# EAGLE schematic PCB2022-20-02 (EAGLE 9.6.2)
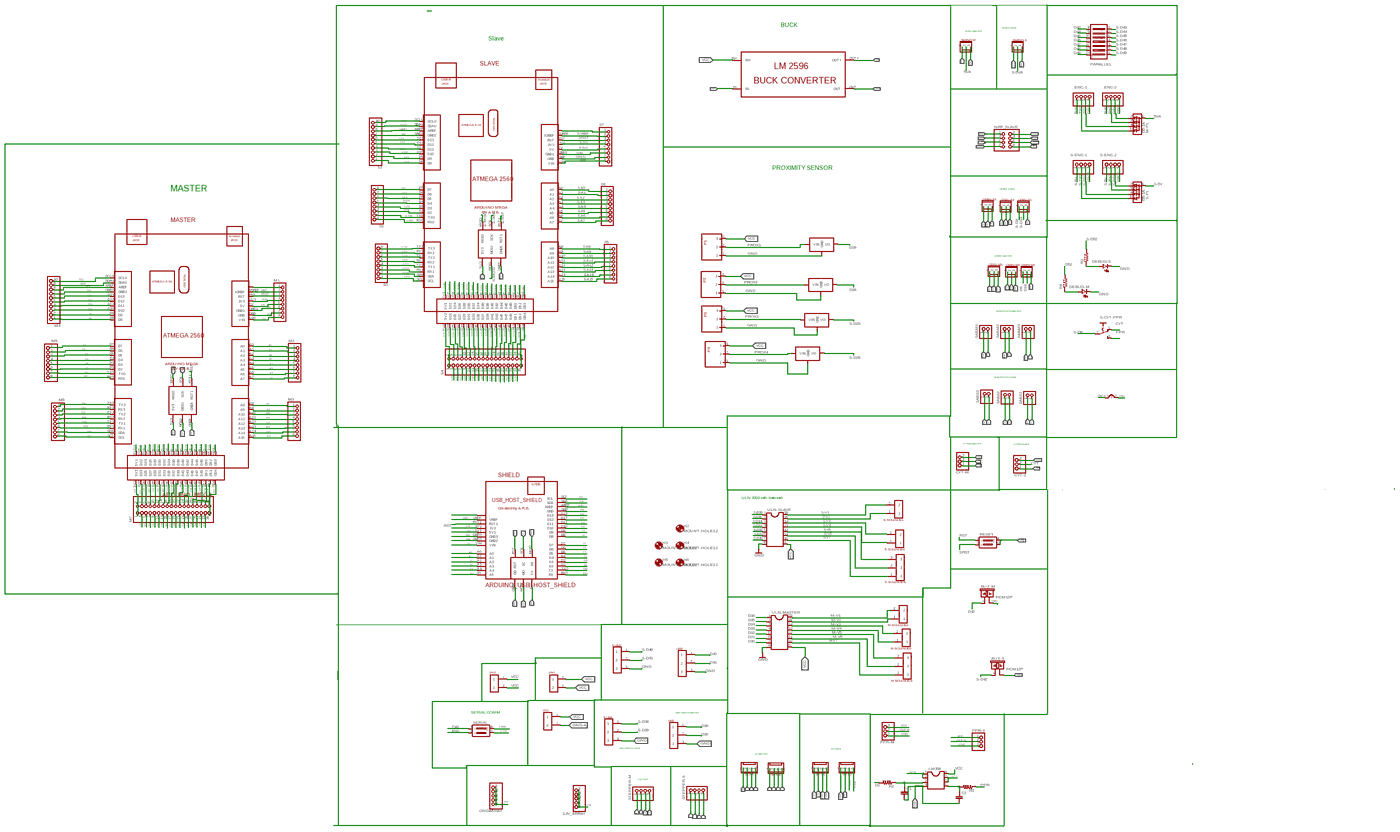
[diagram p0: schematic, sheet 1, overview]
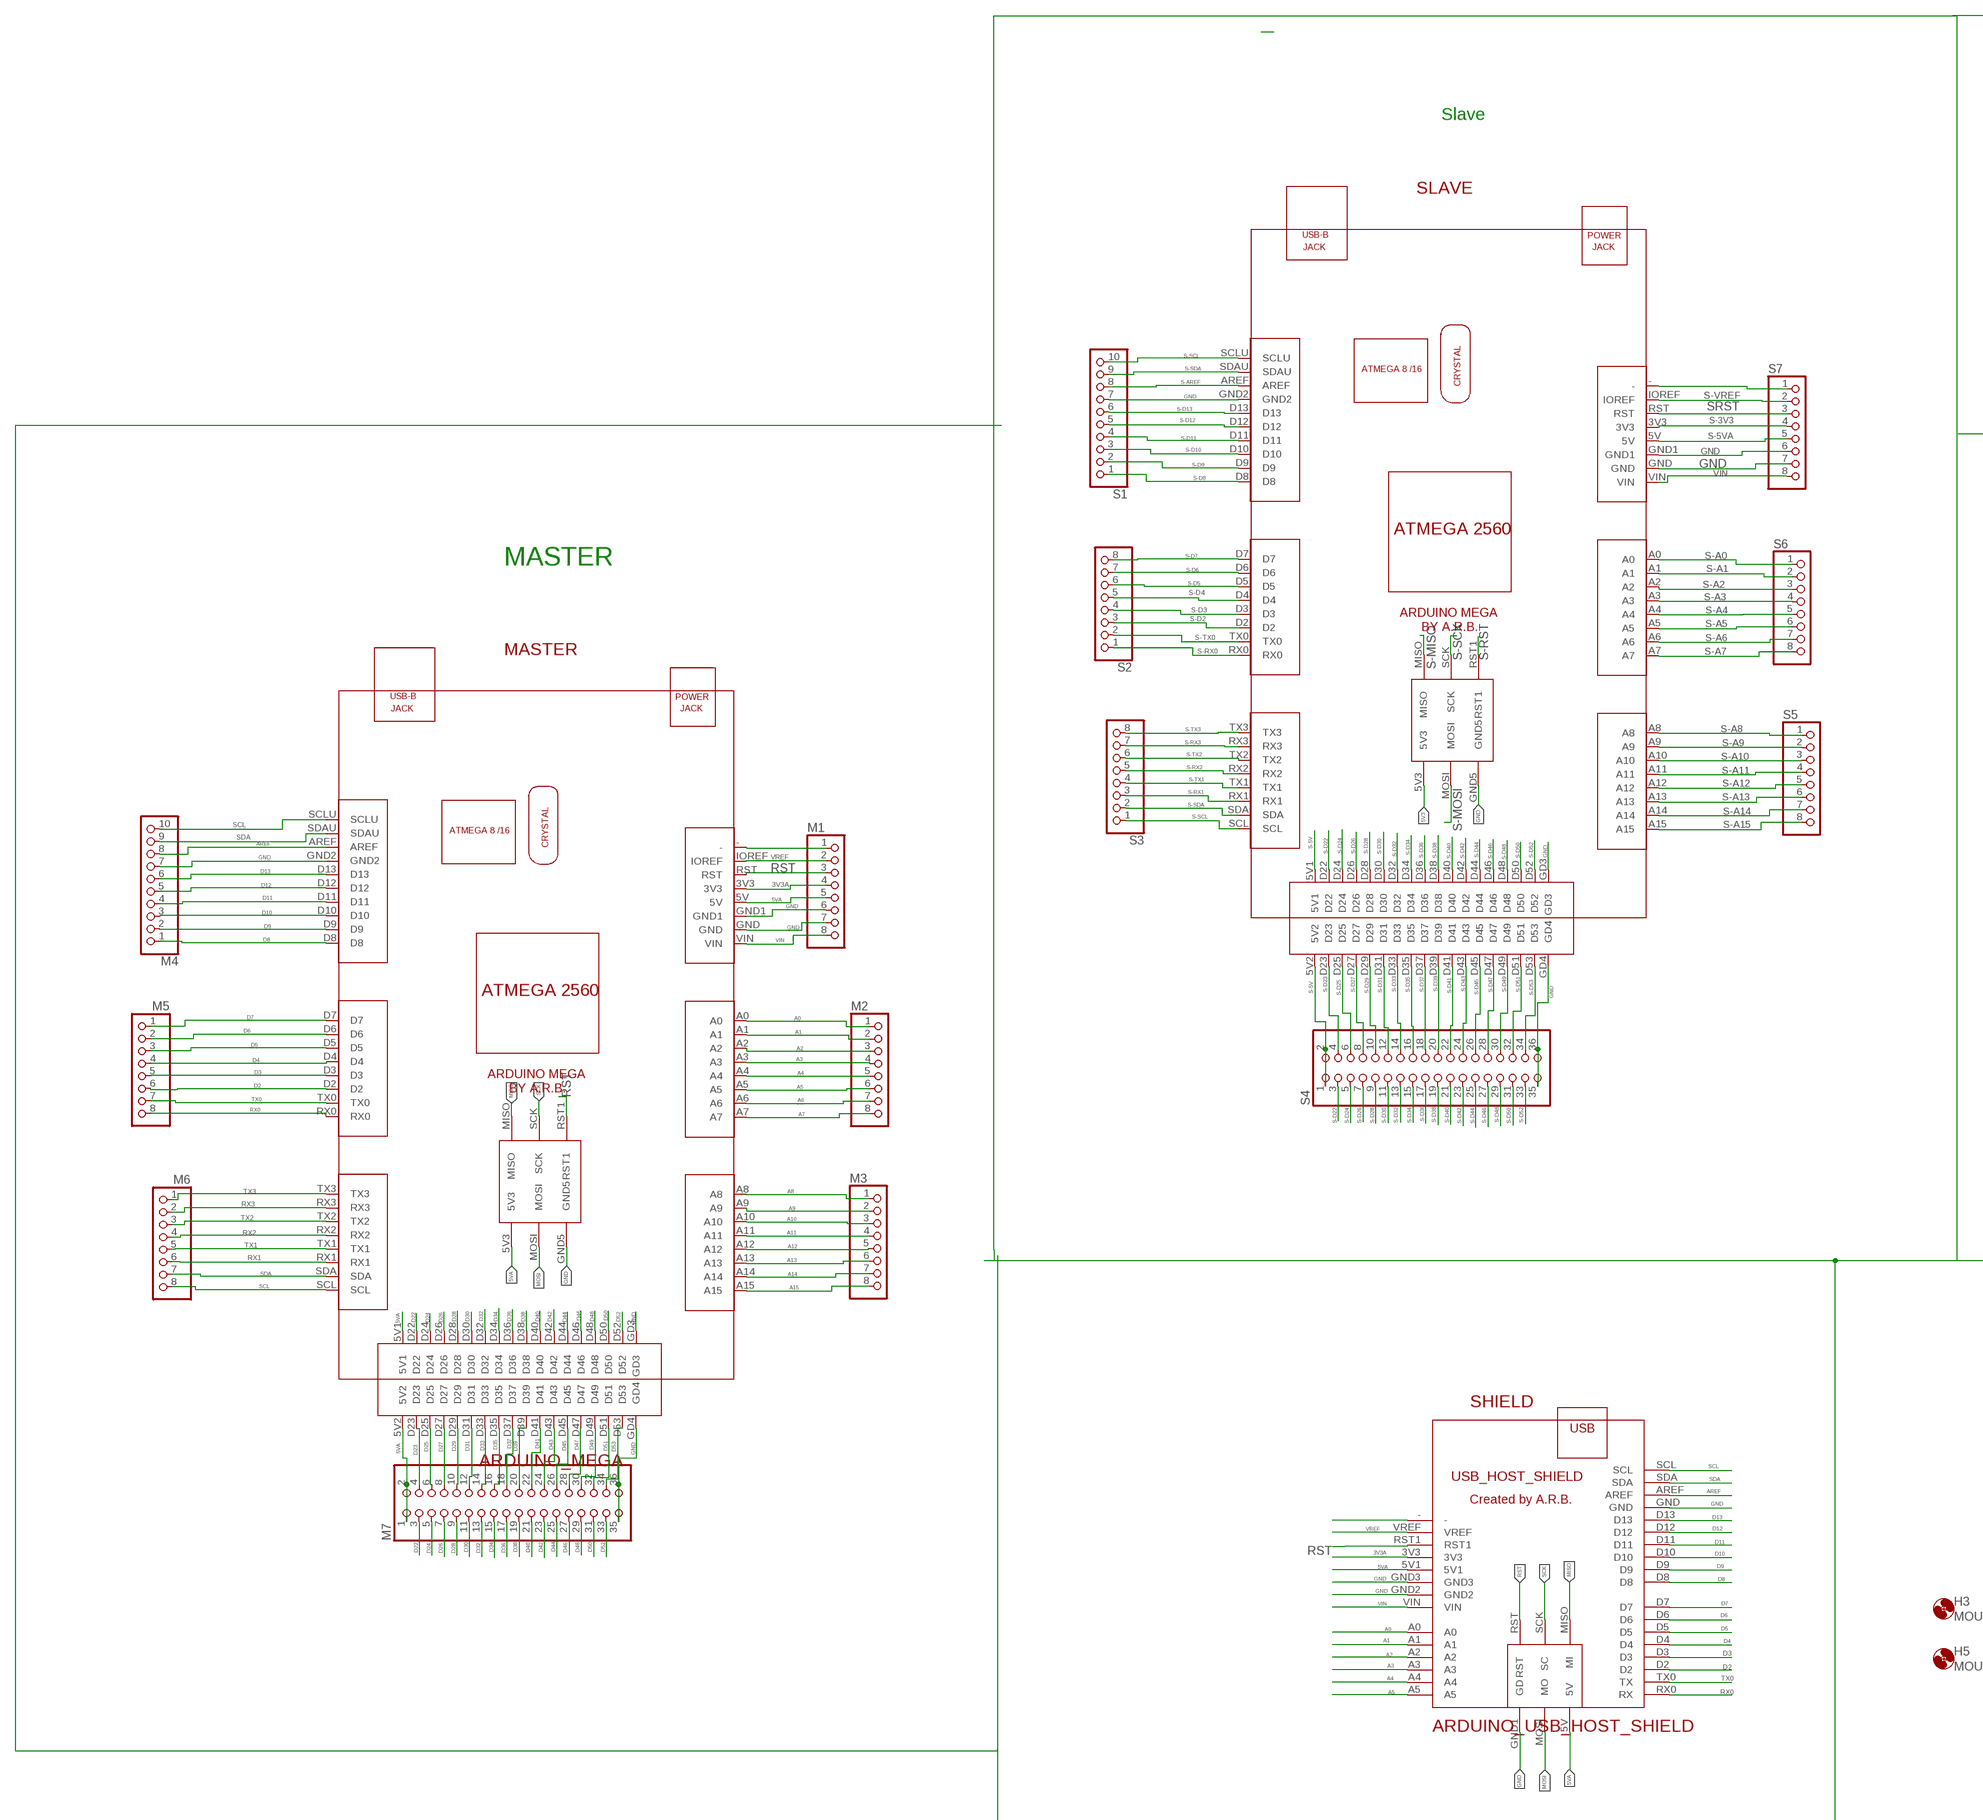
[diagram p1: schematic, sheet 1, part 1 of 4]
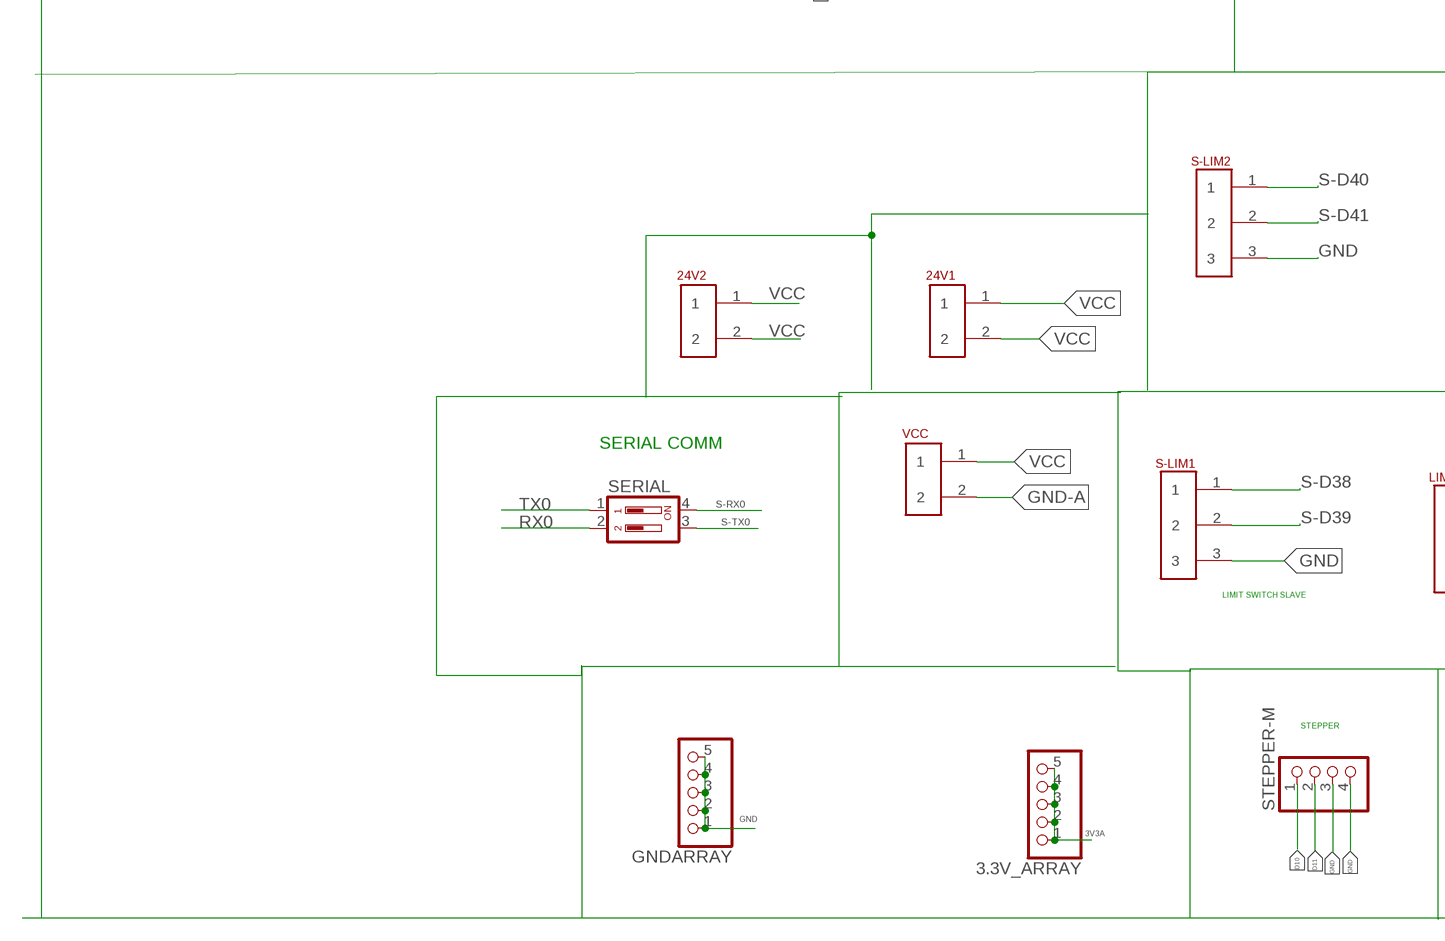
[diagram p2: schematic, sheet 1, part 2 of 4]
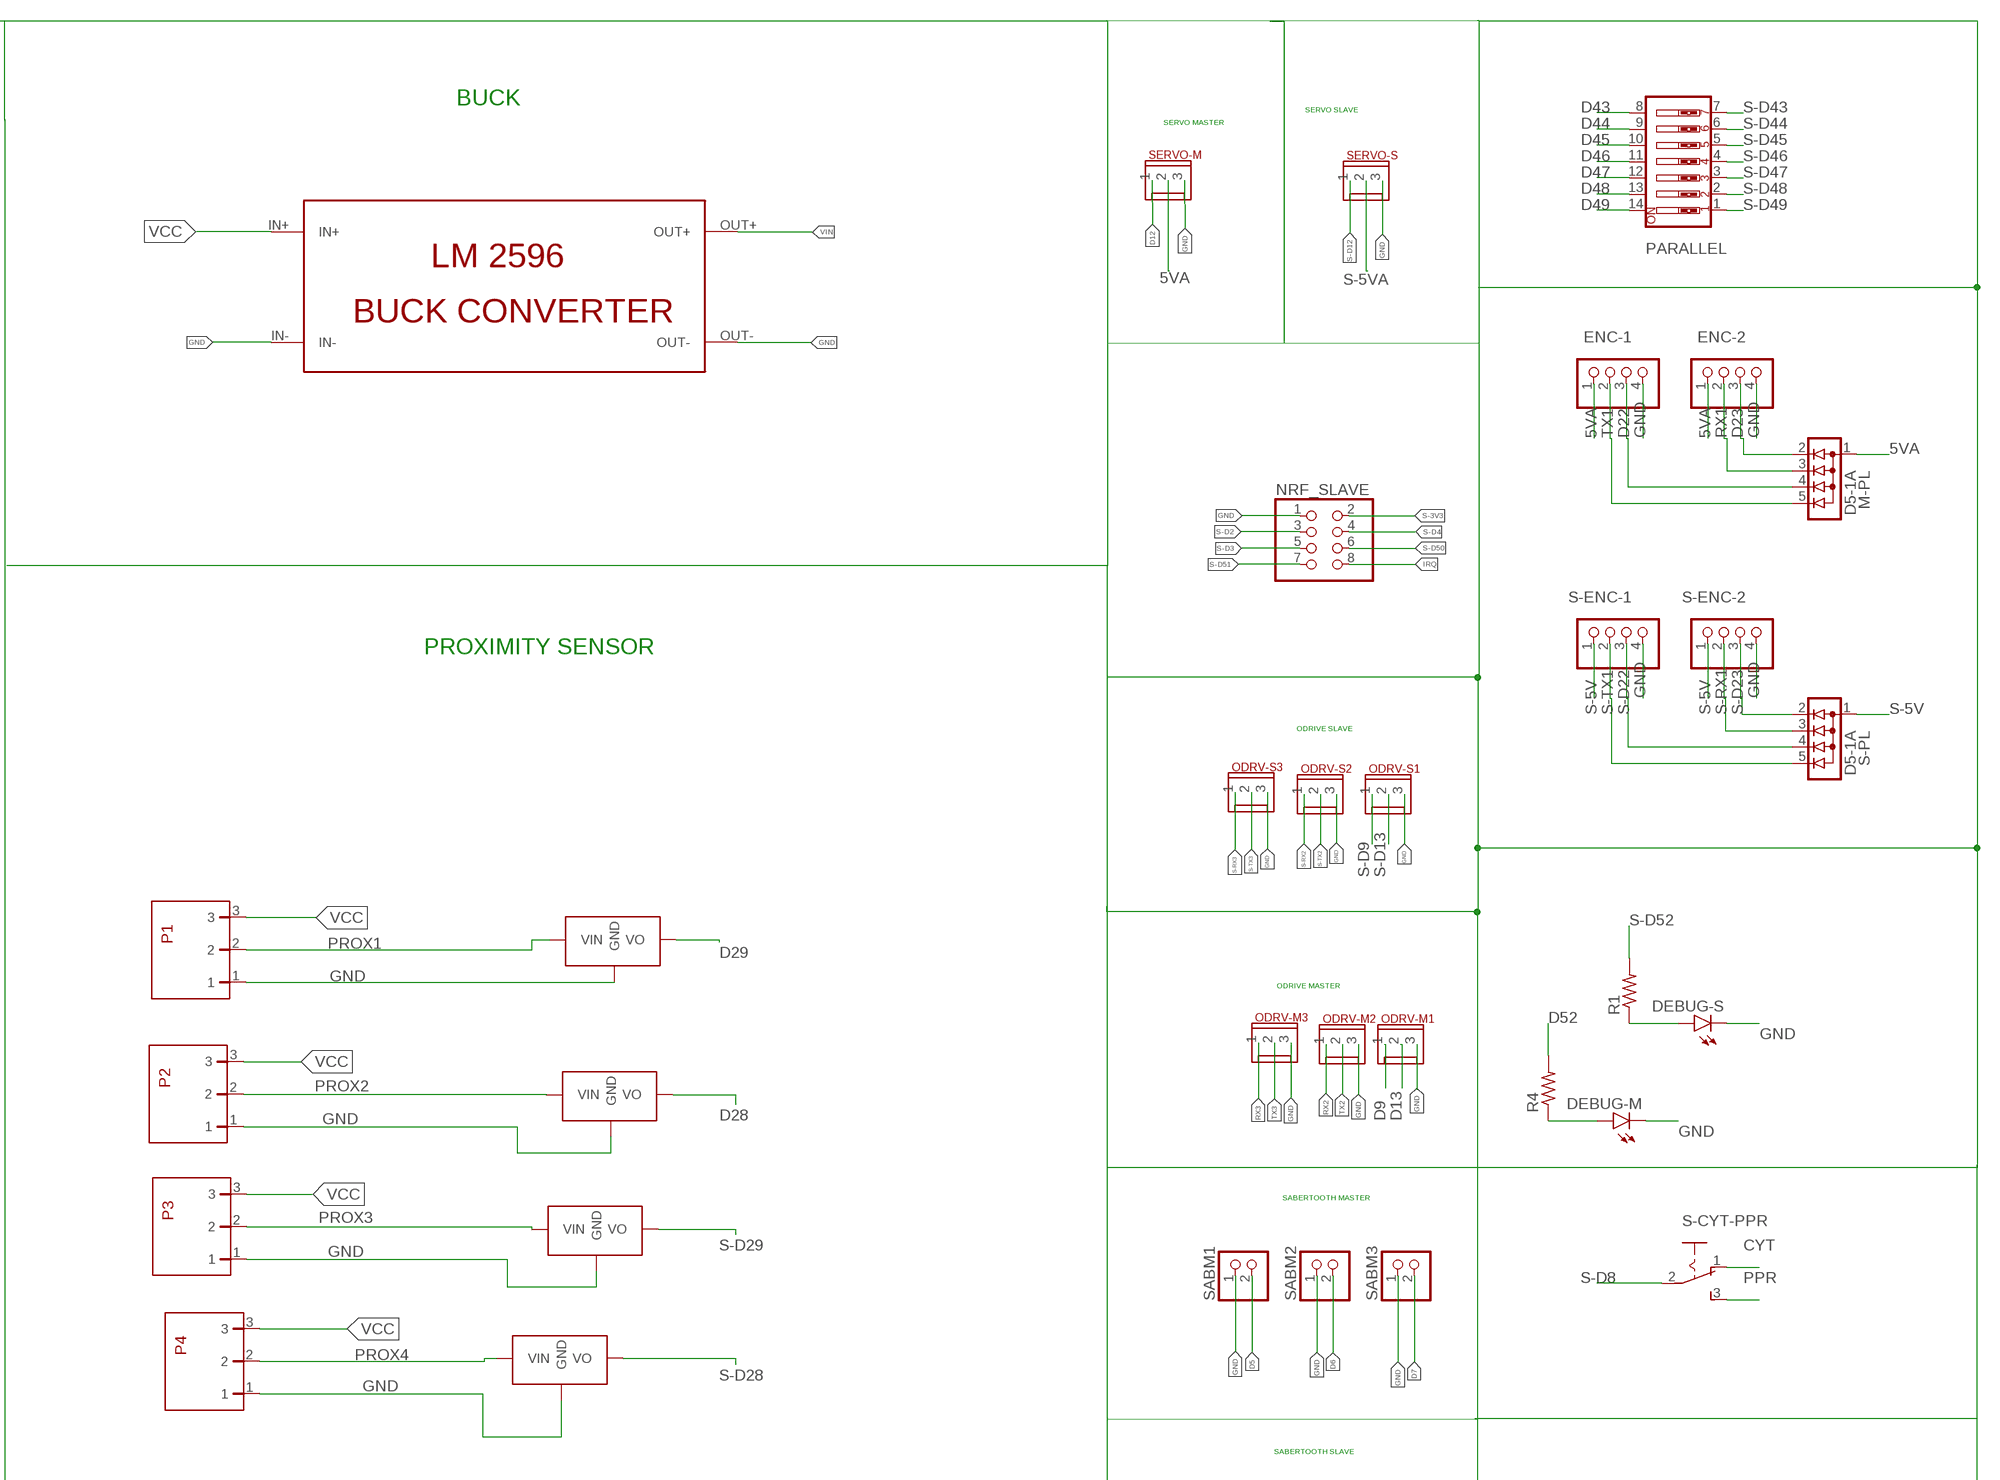
[diagram p3: schematic, sheet 1, part 3 of 4]
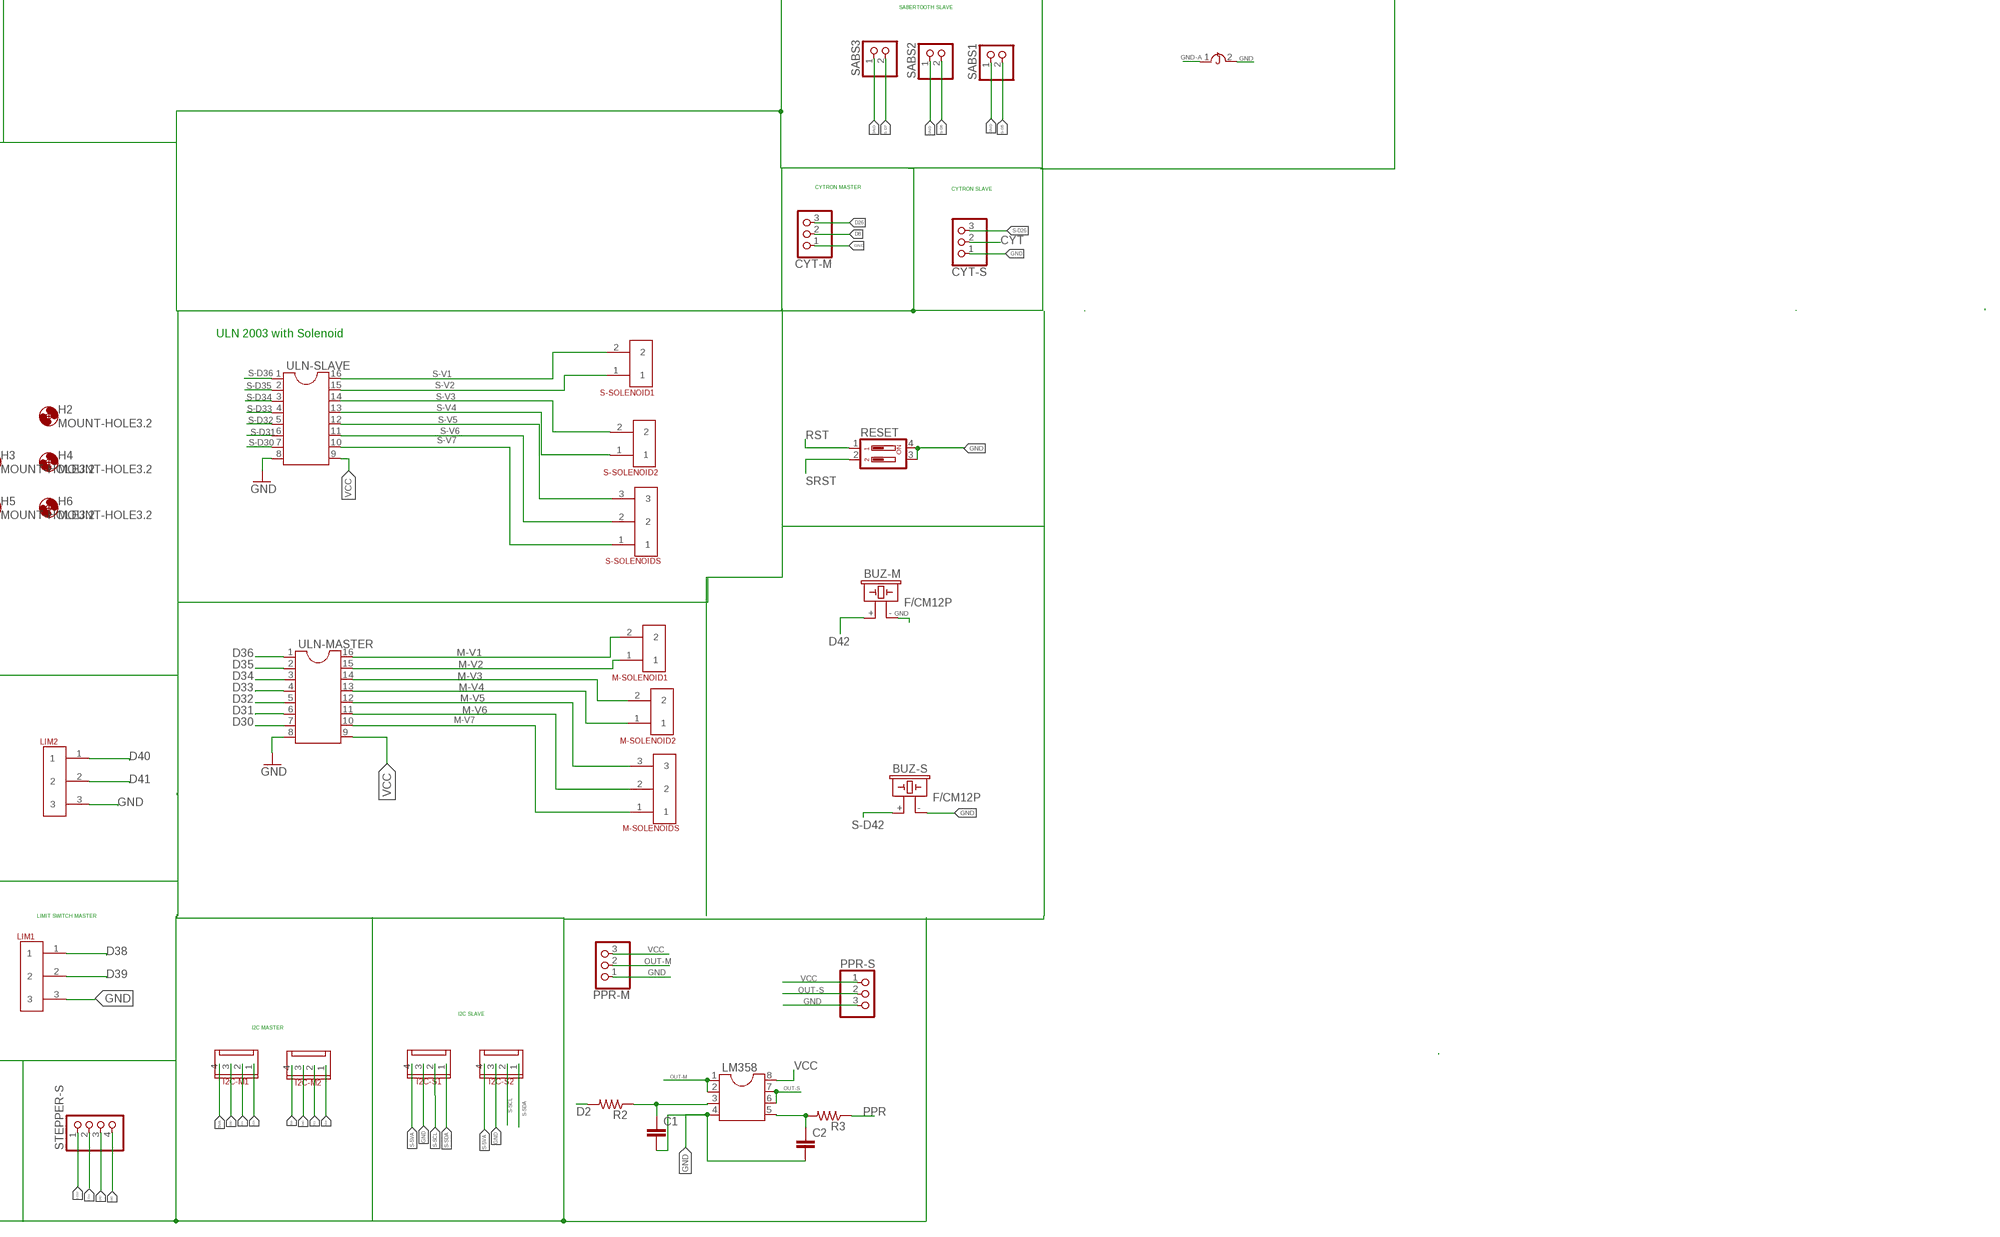
[diagram p4: schematic, sheet 1, part 4 of 4]

## Parts
3.3V_ARRAY  PINHD-1X5  [1X05]
24V1  AB_SCREW_TERMINAL_5MM_2PIN  [AB_SCREW_TERMINAL_5MM_2PIN]
24V2  AB_SCREW_TERMINAL_5MM_2PIN  [AB_SCREW_TERMINAL_5MM_2PIN]
BUZ-M  F/CM12P  [F/CM12P]
BUZ-S  F/CM12P  [F/CM12P]
C1  C-EU025-025X050  [C025-025X050]
C2  C-EU025-025X050  [C025-025X050]
CYT-M  PINHD-1X3  [1X03]
CYT-S  PINHD-1X3  [1X03]
DEBUG-M  LED5MM  [LED5MM]
DEBUG-S  LED5MM  [LED5MM]
ENC-1  PINHD-1X4  [1X04]
ENC-2  PINHD-1X4  [1X04]
GNDARRAY  PINHD-1X5  [1X05]
H2  MOUNT-HOLE3.2  [3,2]
H3  MOUNT-HOLE3.2  [3,2]
H4  MOUNT-HOLE3.2  [3,2]
H5  MOUNT-HOLE3.2  [3,2]
H6  MOUNT-HOLE3.2  [3,2]
I2C-M1  4PIN_RELIMATE_CONNECTOR  [4PIN_RELIMATE_CONNECTOR]
I2C-M2  4PIN_RELIMATE_CONNECTOR  [4PIN_RELIMATE_CONNECTOR]
I2C-S1  4PIN_RELIMATE_CONNECTOR  [4PIN_RELIMATE_CONNECTOR]
I2C-S2  4PIN_RELIMATE_CONNECTOR  [4PIN_RELIMATE_CONNECTOR]
LIM1  AB_SCREW_TER_5MM_3PIN  [AB_SCREW_TER_5MM_3PIN]
LIM2  AB_SCREW_TER_5MM_3PIN  [AB_SCREW_TER_5MM_3PIN]
LM358  DIL8  [DIL08]
M1  PINHD-1X8  [1X08]
M2  PINHD-1X8  [1X08]
M3  PINHD-1X8  [1X08]
M4  PINHD-1X10  [1X10]
M5  PINHD-1X8  [1X08]
M6  PINHD-1X8  [1X08]
M7  PINHD-2X18  [2X18]
M-PL  D5-1A  [SIL05A]
M-SOLENOID1  AB_SCREW_TERMINAL_5MM_2PIN  [AB_SCREW_TERMINAL_5MM_2PIN]
M-SOLENOID2  AB_SCREW_TERMINAL_5MM_2PIN  [AB_SCREW_TERMINAL_5MM_2PIN]
M-SOLENOIDS  AB_SCREW_TER_5MM_3PIN  [AB_SCREW_TER_5MM_3PIN]
MASTER  ARDUINO_MEGA  [ARDUINO_MEGA]
NRF_SLAVE  PINHD-2X4  [2X04]
ODRV-M1  3PIN_RELIMATE_CONNECTOR  [3PIN_RELIMATE_CONNECTOR]
ODRV-M2  3PIN_RELIMATE_CONNECTOR  [3PIN_RELIMATE_CONNECTOR]
ODRV-M3  3PIN_RELIMATE_CONNECTOR  [3PIN_RELIMATE_CONNECTOR]
ODRV-S1  3PIN_RELIMATE_CONNECTOR  [3PIN_RELIMATE_CONNECTOR]
ODRV-S2  3PIN_RELIMATE_CONNECTOR  [3PIN_RELIMATE_CONNECTOR]
ODRV-S3  3PIN_RELIMATE_CONNECTOR  [3PIN_RELIMATE_CONNECTOR]
P1  AB_RIGHT_TER_BLK_3PIN  [AB_RIGHT_TER_BLK_3PIN]
P2  AB_RIGHT_TER_BLK_3PIN  [AB_RIGHT_TER_BLK_3PIN]
P3  AB_RIGHT_TER_BLK_3PIN  [AB_RIGHT_TER_BLK_3PIN]
P4  AB_RIGHT_TER_BLK_3PIN  [AB_RIGHT_TER_BLK_3PIN]
PARALLEL  SW_DIP-7  [EDG-07]
PPR-M  PINHD-1X3  [1X03]
PPR-S  PINHD-1X3  [1X03]
R1  R-US_0204/5  [0204/5]
R2  R-US_0204/5  [0204/5]
R3  R-US_0204/5  [0204/5]
R4  R-US_0204/5  [0204/5]
RESET  DIP02YL  [DIP02YL]
S1  PINHD-1X10  [1X10]
S2  PINHD-1X8  [1X08]
S3  PINHD-1X8  [1X08]
S4  PINHD-2X18  [2X18]
S5  PINHD-1X8  [1X08]
S6  PINHD-1X8  [1X08]
S7  PINHD-1X8  [1X08]
S-CYT-PPR  255SB  [255SB]
S-ENC-1  PINHD-1X4  [1X04]
S-ENC-2  PINHD-1X4  [1X04]
S-LIM1  AB_SCREW_TER_5MM_3PIN  [AB_SCREW_TER_5MM_3PIN]
S-LIM2  AB_SCREW_TER_5MM_3PIN  [AB_SCREW_TER_5MM_3PIN]
S-PL  D5-1A  [SIL05A]
S-SOLENOID1  AB_SCREW_TERMINAL_5MM_2PIN  [AB_SCREW_TERMINAL_5MM_2PIN]
S-SOLENOID2  AB_SCREW_TERMINAL_5MM_2PIN  [AB_SCREW_TERMINAL_5MM_2PIN]
S-SOLENOIDS  AB_SCREW_TER_5MM_3PIN  [AB_SCREW_TER_5MM_3PIN]
SABM1  PINHD-1X2  [1X02]
SABM2  PINHD-1X2  [1X02]
SABM3  PINHD-1X2  [1X02]
SABS1  PINHD-1X2  [1X02]
SABS2  PINHD-1X2  [1X02]
SABS3  PINHD-1X2  [1X02]
SERIAL  DIP02YL  [DIP02YL]
SERVO-M  3PIN_RELIMATE_CONNECTOR  [3PIN_RELIMATE_CONNECTOR]
SERVO-S  3PIN_RELIMATE_CONNECTOR  [3PIN_RELIMATE_CONNECTOR]
SHIELD  ARDUINO_USB_HOST_SHIELD  [ARDUINO_USB_HOST_SHIELD]
SLAVE  ARDUINO_MEGA  [ARDUINO_MEGA]
STEPPER-M  PINHD-1X4  [1X04]
STEPPER-S  PINHD-1X4  [1X04]
U$2  AB_JUMPER_ONE_WAY  [AB_JUMPER_ONE_WAY]
U$3  LM2596_BUCK_CONVERTER  [LM2596_BUCK_CONVERTER]
U$10  AB_7805_FLAT  [AB_7805_FLAT]
U$11  AB_7805_FLAT  [AB_7805_FLAT]
U$12  AB_7805_FLAT  [AB_7805_FLAT]
U$13  AB_7805_FLAT  [AB_7805_FLAT]
ULN-MASTER  DIL16  [DIL16]
ULN-SLAVE  DIL16  [DIL16]
VCC  AB_SCREW_TERMINAL_5MM_2PIN  [AB_SCREW_TERMINAL_5MM_2PIN]

## Nets
3V3A [supply]: 3.3V_ARRAY.1 3.3V_ARRAY.2 3.3V_ARRAY.3 3.3V_ARRAY.4 3.3V_ARRAY.5 M1.4 MASTER.3V3 SHIELD.3V3
5V3 [supply]: SLAVE.5V3
5VA [supply]: ENC-1.1 ENC-2.1 I2C-M1.4 I2C-M2.4 M1.5 M7.1 M7.2 M-PL.1(A) MASTER.5V MASTER.5V1 MASTER.5V2 MASTER.5V3 SERVO-M.2 SHIELD.5V SHIELD.5V1
A0 [arduino master]: M2.1 MASTER.A0 SHIELD.A0
A1 [arduino master]: M2.2 MASTER.A1 SHIELD.A1
A2 [arduino master]: M2.3 MASTER.A2 SHIELD.A2
A3 [arduino master]: M2.4 MASTER.A3 SHIELD.A3
A4 [arduino master]: M2.5 MASTER.A4 SHIELD.A4
A5 [arduino master]: M2.6 MASTER.A5 SHIELD.A5
A6 [arduino master]: M2.7 MASTER.A6
A7 [arduino master]: M2.8 MASTER.A7
A8 [arduino master]: M3.1 MASTER.A8
A9 [arduino master]: M3.2 MASTER.A9
A10 [arduino master]: M3.3 MASTER.A10
A11 [arduino master]: M3.4 MASTER.A11
A12 [arduino master]: M3.5 MASTER.A12
A13 [arduino master]: M3.6 MASTER.A13
A14 [arduino master]: M3.7 MASTER.A14
A15 [arduino master]: M3.8 MASTER.A15
AREF [arduino master]: M4.8 MASTER.AREF SHIELD.AREF
CYT: CYT-S.2 S-CYT-PPR.1(O)
D2 [arduino master]: M5.6 MASTER.D2 R2.2 SHIELD.D2
D3 [arduino master]: M5.5 MASTER.D3 SHIELD.D3
D4 [arduino master]: M5.4 MASTER.D4 SHIELD.D4
D5 [arduino master]: M5.3 MASTER.D5 SABM1.2 SHIELD.D5
D6 [arduino master]: M5.2 MASTER.D6 SABM2.2 SHIELD.D6
D7 [arduino master]: M5.1 MASTER.D7 SABM3.2 SHIELD.D7
D8 [arduino master]: CYT-M.2 M4.1 MASTER.D8 SHIELD.D8
D9 [arduino master]: M4.2 MASTER.D9 ODRV-M1.1 SHIELD.D9
D10 [arduino master]: M4.3 MASTER.D10 SHIELD.D10 STEPPER-M.1
D11 [arduino master]: M4.4 MASTER.D11 SHIELD.D11 STEPPER-M.2
D12 [arduino master]: M4.5 MASTER.D12 SERVO-M.1 SHIELD.D12
D13 [arduino master]: M4.6 MASTER.D13 ODRV-M1.2 SHIELD.D13
D22 [arduino master]: ENC-1.3 M7.3 M-PL.4(C4) MASTER.D22
D23 [arduino master]: ENC-2.3 M7.4 M-PL.2(C2) MASTER.D23
D24 [arduino master]: M7.5 MASTER.D24
D25 [arduino master]: M7.6 MASTER.D25
D26 [arduino master]: CYT-M.3 M7.7 MASTER.D26
D27 [arduino master]: M7.8 MASTER.D27
D28 [arduino master]: M7.9 MASTER.D28 U$11.3(VO)
D29 [arduino master]: M7.10 MASTER.D29 U$10.3(VO)
D30 [arduino master]: M7.11 MASTER.D30 ULN-MASTER.7
D31: M7.12 MASTER.D31 ULN-MASTER.6
D32 [arduino master]: M7.13 MASTER.D32 ULN-MASTER.5
D33 [arduino master]: M7.14 MASTER.D33 ULN-MASTER.4
D34 [arduino master]: M7.15 MASTER.D34 ULN-MASTER.3
D35 [arduino master]: M7.16 MASTER.D35 ULN-MASTER.2
D36 [arduino master]: M7.17 MASTER.D36 ULN-MASTER.1
D37 [arduino master]: M7.18 MASTER.D37
D38 [arduino master]: LIM1.1 M7.19 MASTER.D38
D39 [arduino master]: LIM1.2 M7.20 MASTER.D39
D40 [arduino master]: LIM2.1 M7.21 MASTER.D40
D41 [arduino master]: LIM2.2 M7.22 MASTER.D41
D42 [arduino master]: BUZ-M.+ M7.23 MASTER.D42
D43 [arduino master]: M7.24 MASTER.D43 PARALLEL.8
D44 [arduino master]: M7.25 MASTER.D44 PARALLEL.9
D45 [arduino master]: M7.26 MASTER.D45 PARALLEL.10
D46 [arduino master]: M7.27 MASTER.D46 PARALLEL.11
D47 [arduino master]: M7.28 MASTER.D47 PARALLEL.12
D48 [arduino master]: M7.29 MASTER.D48 PARALLEL.13
D49 [arduino master]: M7.30 MASTER.D49 PARALLEL.14
D50 [arduino master]: M7.31 MASTER.D50
D51 [arduino master]: M7.32 MASTER.D51
D52 [arduino master]: M7.33 MASTER.D52 R4.2
D53 [arduino master]: M7.34 MASTER.D53
GND [supply]: BUZ-M.- BUZ-S.- C1.2 C2.2 CYT-M.1 CYT-S.1 DEBUG-M.K(C) DEBUG-S.K(C) ENC-1.4 ENC-2.4 GNDARRAY.1 GNDARRAY.2 GNDARRAY.3 GNDARRAY.4 GNDARRAY.5 I2C-M1.3 I2C-M2.3 I2C-S1.3 I2C-S2.3 LIM1.3 LIM2.3 LM358.4 M1.6 M1.7 M4.7 M7.35 M7.36 MASTER.GD3 MASTER.GD4 MASTER.GND MASTER.GND1 MASTER.GND2 MASTER.GND5 NRF_SLAVE.1 ODRV-M1.3 ODRV-M2.3 ODRV-M3.3 ODRV-S1.3 ODRV-S2.3 ODRV-S3.3 P1.1 P2.1 P3.1 P4.1 PPR-M.1 PPR-S.3 RESET.3 RESET.4 S1.7 S4.35 S4.36 S7.6 S7.7 S-ENC-1.4 S-ENC-2.4 S-LIM1.3 S-LIM2.3 SABM1.1 SABM2.1 SABM3.1 SABS1.1 SABS2.1 SABS3.1 SERVO-M.3 SERVO-S.3 SHIELD.GND SHIELD.GND1(GD) SHIELD.GND2 SHIELD.GND3 SLAVE.GD3 SLAVE.GD4 SLAVE.GND SLAVE.GND1 SLAVE.GND2 SLAVE.GND5 STEPPER-M.3 STEPPER-M.4 STEPPER-S.3 STEPPER-S.4 U$2.2 U$3.IN- U$3.OUT- U$10.2(GND) U$11.2(GND) U$12.2(GND) U$13.2(GND) ULN-MASTER.8 ULN-SLAVE.8
GND-A [supply]: U$2.1 VCC.2
IRQ: NRF_SLAVE.8
M-V1: M-SOLENOID1.2 ULN-MASTER.16
M-V2: M-SOLENOID1.1 ULN-MASTER.15
M-V3: M-SOLENOID2.2 ULN-MASTER.14
M-V4: M-SOLENOID2.1 ULN-MASTER.13
M-V5: M-SOLENOIDS.3 ULN-MASTER.12
M-V6: M-SOLENOIDS.2 ULN-MASTER.11
M-V7: M-SOLENOIDS.1 ULN-MASTER.10
MISO: MASTER.MISO SHIELD.MISO(MI)
MOSI: MASTER.MOSI SHIELD.MOSI(MO)
N$1: C1.1 LM358.3 R2.1
N$2: DEBUG-S.A R1.1
N$5: C2.1 LM358.5 R3.2
N$8: DEBUG-M.A R4.1
N$18: M1.1 MASTER.-
N$19: S7.1 SLAVE.-
N$20: SHIELD.-
OUT-M: LM358.1 LM358.2 PPR-M.2
OUT-S: LM358.6 LM358.7 PPR-S.2
PPR: R3.1 S-CYT-PPR.3(S)
PROX1 [supply]: P1.2 U$10.1(VIN)
PROX2 [supply]: P2.2 U$11.1(VIN)
PROX3 [supply]: P3.2 U$13.1(VIN)
PROX4 [supply]: P4.2 U$12.1(VIN)
RST [arduino master]: M1.3 MASTER.RST MASTER.RST1 RESET.1 SHIELD.RST SHIELD.RST1
RX0 [arduino master]: M5.8 MASTER.RX0 SERIAL.2 SHIELD.RX0(RX)
RX1 [arduino master]: ENC-2.2 M6.6 M-PL.3(C3) MASTER.RX1
RX2 [arduino master]: M6.4 MASTER.RX2 ODRV-M2.1
RX3: M6.2 MASTER.RX3 ODRV-M3.1
S-3V3 [supply]: NRF_SLAVE.2 S7.4 SLAVE.3V3
S-5V [supply]: S4.1 S4.2 S-ENC-1.1 S-ENC-2.1 S-PL.1(A) SLAVE.5V1 SLAVE.5V2
S-5VA [supply]: I2C-S1.4 I2C-S2.4 S7.5 SERVO-S.2 SLAVE.5V
S-A0 [arduino slave]: S6.1 SLAVE.A0
S-A1 [arduino slave]: S6.2 SLAVE.A1
S-A2 [arduino slave]: S6.3 SLAVE.A2
S-A3 [arduino slave]: S6.4 SLAVE.A3
S-A4 [arduino slave]: S6.5 SLAVE.A4
S-A5 [arduino slave]: S6.6 SLAVE.A5
S-A6 [arduino slave]: S6.7 SLAVE.A6
S-A7 [arduino slave]: S6.8 SLAVE.A7
S-A8 [arduino slave]: S5.1 SLAVE.A8
S-A9 [arduino slave]: S5.2 SLAVE.A9
S-A10 [arduino slave]: S5.3 SLAVE.A10
S-A11 [arduino slave]: S5.4 SLAVE.A11
S-A12 [arduino slave]: S5.5 SLAVE.A12
S-A13 [arduino slave]: S5.6 SLAVE.A13
S-A14 [arduino slave]: S5.7 SLAVE.A14
S-A15 [arduino slave]: S5.8 SLAVE.A15
S-AREF [arduino slave]: S1.8 SLAVE.AREF
S-D2 [arduino slave]: NRF_SLAVE.3 S2.3 SLAVE.D2
S-D3 [arduino slave]: NRF_SLAVE.5 S2.4 SLAVE.D3
S-D4 [arduino slave]: NRF_SLAVE.4 S2.5 SLAVE.D4
S-D5 [arduino slave]: S2.6 SABS1.2 SLAVE.D5
S-D6: S2.7 SABS2.2 SLAVE.D6
S-D7 [arduino slave]: S2.8 SABS3.2 SLAVE.D7
S-D8 [arduino slave]: S1.1 S-CYT-PPR.2(P) SLAVE.D8
S-D9 [arduino slave]: ODRV-S1.1 S1.2 SLAVE.D9
S-D10 [arduino slave]: S1.3 SLAVE.D10 STEPPER-S.1
S-D11 [arduino slave]: S1.4 SLAVE.D11 STEPPER-S.2
S-D12 [arduino slave]: S1.5 SERVO-S.1 SLAVE.D12
S-D13 [arduino slave]: ODRV-S1.2 S1.6 SLAVE.D13
S-D22 [arduino slave]: S4.3 S-ENC-1.3 S-PL.4(C4) SLAVE.D22
S-D23 [arduino slave]: S4.4 S-ENC-2.3 S-PL.2(C2) SLAVE.D23
S-D24 [arduino slave]: S4.5 SLAVE.D24
S-D25 [arduino slave]: S4.6 SLAVE.D25
S-D26 [arduino slave]: CYT-S.3 S4.7 SLAVE.D26
S-D27 [arduino slave]: S4.8 SLAVE.D27
S-D28 [arduino slave]: S4.9 SLAVE.D28 U$12.3(VO)
S-D29 [arduino slave]: S4.10 SLAVE.D29 U$13.3(VO)
S-D30 [arduino slave]: S4.11 SLAVE.D30 ULN-SLAVE.7
S-D31 [arduino slave]: S4.12 SLAVE.D31 ULN-SLAVE.6
S-D32 [arduino slave]: S4.13 SLAVE.D32 ULN-SLAVE.5
S-D33 [arduino slave]: S4.14 SLAVE.D33 ULN-SLAVE.4
S-D34 [arduino slave]: S4.15 SLAVE.D34 ULN-SLAVE.3
S-D35 [arduino slave]: S4.16 SLAVE.D35 ULN-SLAVE.2
S-D36 [arduino slave]: S4.17 SLAVE.D36 ULN-SLAVE.1
S-D37 [arduino slave]: S4.18 SLAVE.D37
S-D38 [arduino slave]: S4.19 S-LIM1.1 SLAVE.D38
S-D39 [arduino slave]: S4.20 S-LIM1.2 SLAVE.D39
S-D40 [arduino slave]: S4.21 S-LIM2.1 SLAVE.D40
S-D41 [arduino slave]: S4.22 S-LIM2.2 SLAVE.D41
S-D42 [arduino slave]: BUZ-S.+ S4.23 SLAVE.D42
S-D43 [arduino slave]: PARALLEL.7 S4.24 SLAVE.D43
S-D44 [arduino slave]: PARALLEL.6 S4.25 SLAVE.D44
S-D45 [arduino slave]: PARALLEL.5 S4.26 SLAVE.D45
S-D46 [arduino slave]: PARALLEL.4 S4.27 SLAVE.D46
S-D47 [arduino slave]: PARALLEL.3 S4.28 SLAVE.D47
S-D48: PARALLEL.2 S4.29 SLAVE.D48
S-D49 [arduino slave]: PARALLEL.1 S4.30 SLAVE.D49
S-D50 [arduino slave]: NRF_SLAVE.6 S4.31 SLAVE.D50
S-D51 [arduino slave]: NRF_SLAVE.7 S4.32 SLAVE.D51
S-D52 [arduino slave]: R1.2 S4.33 SLAVE.D52
S-D53 [arduino slave]: S4.34 SLAVE.D53
S-MISO: SLAVE.MISO
S-MOSI: SLAVE.MOSI
S-RST: SLAVE.RST1
S-RX0 [arduino slave]: S2.1 SERIAL.4 SLAVE.RX0
S-RX1 [arduino slave]: S3.3 S-ENC-2.2 S-PL.3(C3) SLAVE.RX1
S-RX2 [arduino slave]: ODRV-S2.1 S3.5 SLAVE.RX2
S-RX3 [arduino slave]: ODRV-S3.1 S3.7 SLAVE.RX3
S-SCK: SLAVE.SCK
S-SCL [arduino slave]: I2C-S1.2 I2C-S2.2 S1.10 S3.1 SLAVE.SCL SLAVE.SCLU
S-SDA [arduino slave]: I2C-S1.1 I2C-S2.1 S1.9 S3.2 SLAVE.SDA SLAVE.SDAU
S-TX0 [arduino slave]: S2.2 SERIAL.3 SLAVE.TX0
S-TX1 [arduino slave]: S3.4 S-ENC-1.2 S-PL.5(C5) SLAVE.TX1
S-TX2 [arduino slave]: ODRV-S2.2 S3.6 SLAVE.TX2
S-TX3 [arduino slave]: ODRV-S3.2 S3.8 SLAVE.TX3
S-V1: S-SOLENOID1.2 ULN-SLAVE.16
S-V2: S-SOLENOID1.1 ULN-SLAVE.15
S-V3: S-SOLENOID2.2 ULN-SLAVE.14
S-V4: S-SOLENOID2.1 ULN-SLAVE.13
S-V5: S-SOLENOIDS.3 ULN-SLAVE.12
S-V6: S-SOLENOIDS.2 ULN-SLAVE.11
S-V7: S-SOLENOIDS.1 ULN-SLAVE.10
S-VREF [supply]: S7.2 SLAVE.IOREF
SCK: MASTER.SCK SHIELD.SCK(SC)
SCL [arduino master]: I2C-M1.2 I2C-M2.2 M4.10 M6.8 MASTER.SCL MASTER.SCLU SHIELD.SCL
SDA [arduino master]: I2C-M1.1 I2C-M2.1 M4.9 M6.7 MASTER.SDA MASTER.SDAU SHIELD.SDA
SRST: RESET.2 S7.3 SLAVE.RST
TX0 [arduino master]: M5.7 MASTER.TX0 SERIAL.1 SHIELD.TX0(TX)
TX1 [arduino master]: ENC-1.2 M6.5 M-PL.5(C5) MASTER.TX1
TX2 [arduino master]: M6.3 MASTER.TX2 ODRV-M2.2
TX3: M6.1 MASTER.TX3 ODRV-M3.2
VCC: 24V1.1 24V1.2 24V2.1 24V2.2 LM358.8 P1.3 P2.3 P3.3 P4.3 PPR-M.3 PPR-S.1 U$3.IN+ ULN-MASTER.9 ULN-SLAVE.9 VCC.1
VIN [supply]: M1.8 MASTER.VIN S7.8 SHIELD.VIN SLAVE.VIN U$3.OUT+
VREF: M1.2 MASTER.IOREF SHIELD.VREF

## Notes on the sheet
- BUCK
- SERVO SLAVE
- SERVO MASTER
- Slave
- PROXIMITY SENSOR
- ODRIVE SLAVE
- MASTER
- ODRIVE MASTER
- SABERTOOTH MASTER
- SABERTOOTH SLAVE
- CYTRON MASTER
- CYTRON SLAVE
- ULN 2003 with Solenoid
- SERIAL COMM | LIMIT SWITCH MASTER
- LIMIT SWITCH SLAVE
- I2C SLAVE
- I2C MASTER
- STEPPER

## Library data of the parts
3.3V_ARRAY GNDARRAY = pinhead:PINHD-1X5: PIN HEADER
24V1 24V2 M-SOLENOID1 M-SOLENOID2 S-SOLENOID1 S-SOLENOID2 VCC = AB_SCREW_TER_5MM_2PIN_BIG:AB_SCREW_TERMINAL_5MM_2PIN
BUZ-M BUZ-S = buzzer:F/CM12P: BUZZER Source: Buerklin; OC_FARNELL: unknown; OC_NEWARK: unknown
C1 C2 = rcl:C-EU: CAPACITOR, European symbol; SPICEPREFIX: C
CYT-M CYT-S PPR-M PPR-S = pinhead:PINHD-1X3: PIN HEADER
DEBUG-M DEBUG-S = led:LED: LED OSRAM: - CHIPLED LG R971, LG N971, LY N971, LG Q971, LY Q971, LO R971, LY R971 LH N974, LH R974 LS Q976, LO Q976, LY Q976 LO Q996 - Hyper CHIPLED LW Q18S LB Q993, LB Q99A, LB R99A - SideLED LS A670, LO A670, LY A670, LG A670, LP A670 LB A673, LV A673, LT A673, LW A673 LH A674 LY A675 LS A676, LA A676, LO A676, LY A676, LW A676 LS A679, LY A679, LG A679 - Hyper Micro SIDELED® LS Y876, LA Y876, LO Y876, LY Y876 LT Y87S - SmartLED LW L88C, LW L88S LB L89C, LB L89S, LG L890 LS L89K, LO L89K, LY L89K LS L896, LA L896, LO L896, LY L896 - TOPLED LS T670, LO T670, LY T670, LG T670, LP T670 LSG T670, LSP T670, LSY T670, LOP T670, LYG T670 LG T671, LOG T671, LSG T671 LB T673, LV T673, LT T673, LW T673 LH T674 LS T676, LA T676, LO T676, LY T676, LB T676, LH T676, LSB T676, LW T676 LB T67C, LV T67C, LT T67C, LS T67K, LO T67K, LY T67K, LW E67C LS E67B, LA E67B, LO E67B, LY E67B, LB E67C, LV E67C, LT E67C LW T67C LS T679, LY T679, LG T679 LS T770, LO T770, LY T770, LG T770, LP T770 LB T773, LV T773, LT T773, LW T773 LH T774 LS E675, LA E675, LY E675, LS T675 LS T776, LA T776, LO T776, LY T776, LB T776 LHGB T686 LT T68C, LB T68C - Hyper Mini TOPLED® LB M676 - Mini TOPLED Santana® LG M470 LS M47K, LO M47K, LY M47K Source: http://www.osram.convergy.de LUXEON: - LUMILED® LXK2-PW12-R00, LXK2-PW12-S00, LXK2-PW14-U00, LXK2-PW14-V00 LXK2-PM12-R00, LXK2-PM12-S00, LXK2-PM14-U00 LXK2-PE12-Q00, LXK2-PE12-R00, LXK2-PE12-S00, LXK2-PE14-T00, LXK2-PE14-U00 LXK2-PB12-K00, LXK2-PB12-L00, LXK2-PB12-M00, LXK2-PB14-N00, LXK2-PB14-P00, LXK2-PB14-Q00 LXK2-PR12-L00, LXK2-PR12-M00, LXK2-PR14-Q00, LXK2-PR14-R00 LXK2-PD12-Q00, LXK2-PD12-R00, LXK2-PD12-S00 LXK2-PH12-R00, LXK2-PH12-S00 LXK2-PL12-P00, LXK2-PL12-Q00, LXK2-PL12-R00 Source: www.luxeon.com KINGBRIGHT: KA-3528ASYC Source: www.kingbright.com
ENC-1 ENC-2 S-ENC-1 S-ENC-2 STEPPER-M STEPPER-S = pinhead:PINHD-1X4: PIN HEADER
H2-H6 = holes:MOUNT-HOLE: MOUNTING HOLE with drill center marker
I2C-M1 I2C-M2 I2C-S1 I2C-S2 = RELIMATE_CONNECTORS:4PIN_RELIMATE_CONNECTOR: RELIMATE CONNECTOR Created by Aadesh Borate PITCH = 2.54 mm
LIM1 LIM2 M-SOLENOIDS S-LIM1 S-LIM2 S-SOLENOIDS = AB_SCREW_TER_5MM_3PIN_BIG:AB_SCREW_TER_5MM_3PIN
LM358 = ic-package:DIL8: Dual In Line / Socket
M1-M3 M5 M6 S2 S3 S5-S7 = pinhead:PINHD-1X8: PIN HEADER
M4 S1 = pinhead:PINHD-1X10: PIN HEADER
M7 S4 = pinhead:PINHD-2X18: PIN HEADER
M-PL S-PL = diode:D5-1A: 4 DIODES SIL, common anode
MASTER SLAVE = ARDUINO_MEGA:ARDUINO_MEGA: Arduino MEGA 2560 Created by Aadesh Borate Features : Microcontroller ATmega2560 Operating Voltage (logic level) : 5 V Input Voltage (Recommended) : 7-12 V Digital I/O Pins : 54 (of which 15 provide PWM output) Analog Input Pins : 16 DC Current per I/O Pin : 20 mA Flash Memory : 256 KB of which 8 KB used by bootloader SRAM: 8 KB EEPROM: 4 KB Clock Speed: 16 MHz Dimensions : 101.52 mm × 53.3 mm Buy this module at Robu.in <https://robu.in/product/atmel-mcu-atmega16u2-mega-2560-r3-improved-version-ch340g-cable-arduino-mega-2560-transparent-acrylic-case-arduino-mega-2560/> <
NRF_SLAVE = pinhead:PINHD-2X4: PIN HEADER
ODRV-M1-ODRV-M3 ODRV-S1-ODRV-S3 SERVO-M SERVO-S = RELIMATE_CONNECTORS:3PIN_RELIMATE_CONNECTOR: RELIMATE CONNECTOR Created by Aadesh Borate PITCH = 2.54 mm
P1-P4 = AB_Right_angle_terminal_block:AB_RIGHT_TER_BLK_3PIN
PARALLEL = special:SW_DIP-7: DIP SWITCH
R1-R4 = rcl:R-US_: RESISTOR, American symbol; SPICEPREFIX: R
RESET SERIAL = switch-dil:DIP02YL: DIL/CODE SWITCH; OC_FARNELL: unknown; OC_NEWARK: unknown
S-CYT-PPR = switch:255SB: SLIDING SWITCH Distributor Buerklin, 11G810
SABM1 = pinhead:PINHD-1X2: PIN HEADER; SPICEPREFIX: B
SABM2 SABM3 SABS1-SABS3 = pinhead:PINHD-1X2: PIN HEADER
SHIELD = ARDUINO_USB_HOST_SHIELD:ARDUINO_USB_HOST_SHIELD: Arduino USB Host Shield Created by Aadesh Borate Features : Operating voltage : 5V USB Controller : MAX3421E Max Current : 500mA when Arduino is powered by a suitable power supply connected to the Arduino power jack Max Current : 400mA when Arduino is powered by its USB port Buy this module at Rhydolabz <https://www.rhydolabz.com/arduino-arduino-shields-c-152_151/arduino-usb-host-shield-original-arduino-p-1980.html> <
U$2 = AB_SMD_JUMPER:AB_JUMPER_ONE_WAY
U$3 = VOLTAGE_CONVERTERS:LM2596_BUCK_CONVERTER: LM2596 Buck Converter Created by Aadesh Borate Features : Adjustable Output Voltage Range : 1.23V − 37V Output Load Current : 3.0A Wide Input Voltage Range up to 40V 150 kHz Fixed Frequency Internal Oscillator TTL Shutdown Capability Thermal Shutdown and Current Limit Protection Buy this module at Robu.in <https://robu.in/product/lm2596s-dc-dc-buck-converter-power-supply/> <
U$10-U$13 = AB_7805_FLAT:AB_7805_FLAT
ULN-MASTER ULN-SLAVE = ic-package:DIL16: Dual In Line / Socket

## Net classes
0 default: width 0.305 mm, drill 0.33 mm, clearance 0.203 mm
1 arduino master: width 0.305 mm, drill 0.356 mm, clearance 0.254 mm
2 arduino slave: width 0.305 mm, drill 0.356 mm, clearance 0.254 mm
3 supply: width 0.305 mm, drill 0.356 mm, clearance 0.254 mm
4 vin: width 1.016 mm, drill 0.356 mm, clearance 0.305 mm